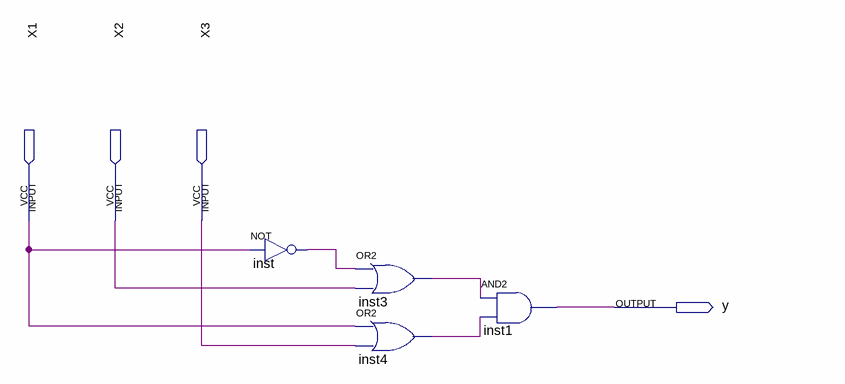
[diagram p0: schematic sheet]
// Quartus schematic scheme4.bdf as structural Verilog: 4 symbols, 4 pins
module scheme4 (
  input  X1,
  input  X2,
  input  X3,
  output y
);

  wire inst3_out, inst4_out, inst_out;

  not inst (inst_out, X1);
  or inst3 (inst3_out, inst_out, X2);
  or inst4 (inst4_out, X1, X3);
  and inst1 (y, inst3_out, inst4_out);
endmodule
